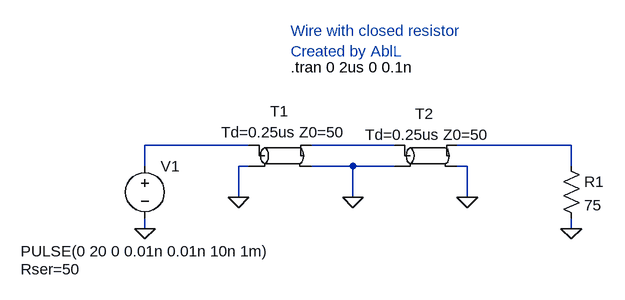
[diagram p0: schematic Leitungstheorie-Abgeschlossene-Leitung.asc]
Leitungstheorie-Abgeschlossene-Leitung.asc, the LTspice schematic file:
Version 4
SHEET 1 880 680
WIRE 16 112 -144 112
WIRE 240 112 112 112
WIRE 512 112 336 112
WIRE -144 144 -144 112
WIRE 16 144 0 144
WIRE 176 144 112 144
WIRE 240 144 176 144
WIRE 352 144 336 144
WIRE 512 144 512 112
WIRE 0 192 0 144
WIRE 176 192 176 144
WIRE 352 192 352 144
WIRE -144 240 -144 224
WIRE 512 240 512 224
FLAG 0 192 0
FLAG 176 192 0
FLAG 352 192 0
FLAG 512 240 0
FLAG -144 240 0
SYMBOL tline 64 128 R0
WINDOW 0 -1 -53 Bottom 2
WINDOW 3 5 -52 Top 2
SYMATTR InstName T1
SYMATTR Value Td=0.25us Z0=50
SYMBOL tline 288 128 R0
WINDOW 0 -2 -49 Bottom 2
WINDOW 3 3 -48 Top 2
SYMATTR InstName T2
SYMATTR Value Td=0.25us Z0=50
SYMBOL res 496 128 R0
SYMATTR InstName R1
SYMATTR Value 75
SYMBOL voltage -144 128 R0
WINDOW 3 -191 147 Left 2
WINDOW 123 0 0 Left 0
WINDOW 39 -191 175 Left 2
SYMATTR Value PULSE(0 20 0 0.01n 0.01n 10n 1m)
SYMATTR SpiceLine Rser=50
SYMATTR InstName V1
TEXT 80 -8 Left 2 !.tran 0 2us 0 0.1n
TEXT 80 -64 Left 2 ;Wire with closed resistor\nCreated by AblL

The netlist it stands for:
* Leitungstheorie-Abgeschlossene-Leitung.asc
T1 N001 0 N002 0 Td=0.25us Z0=50
T2 N002 0 N003 0 Td=0.25us Z0=50
R1 N003 0 75
V1 N001 0 PULSE(0 20 0 0.01n 0.01n 10n 1m) Rser=50
.tran 0 2us 0 0.1n
* Wire with closed resistor
* Created by AblL
.backanno
.end